# EAGLE schematic KEX V1 (EAGLE 7.5.0)
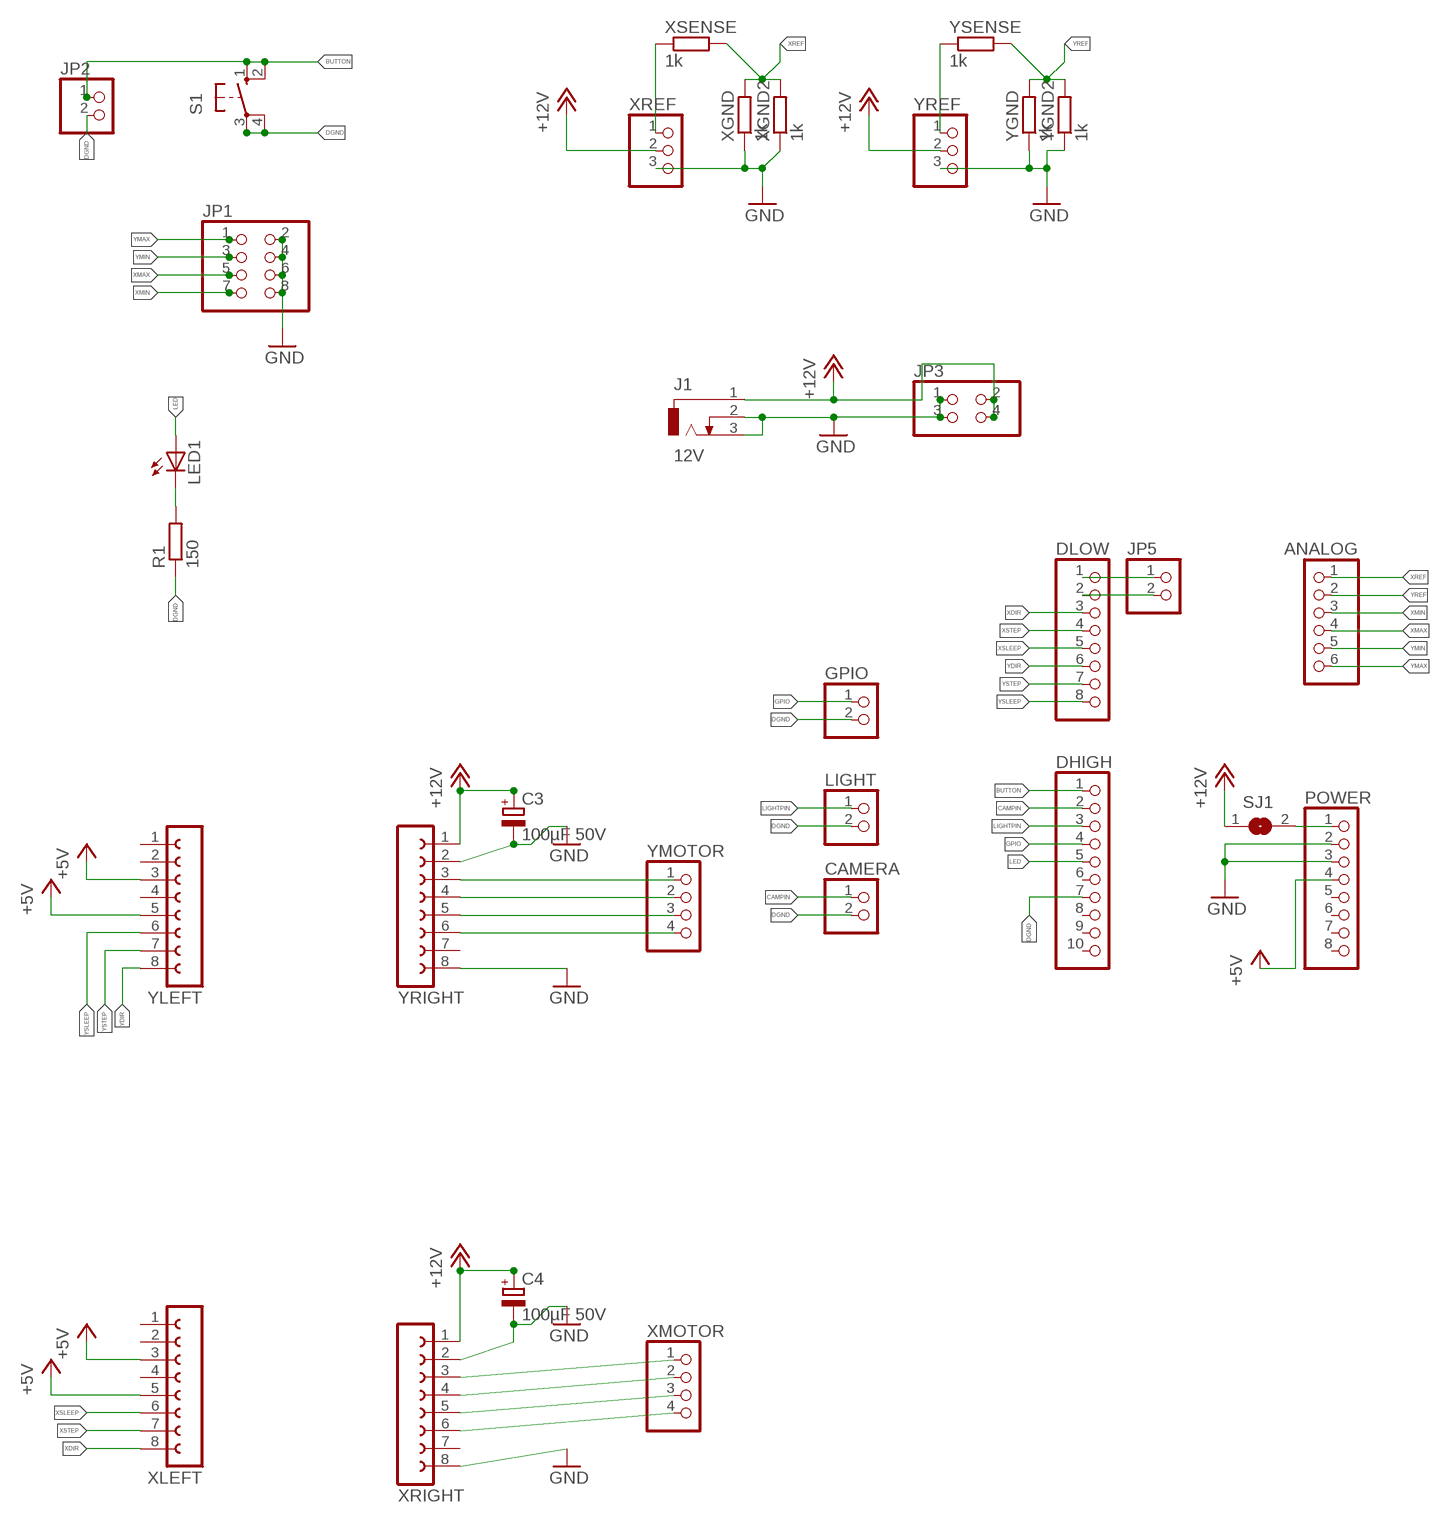
[diagram p0: schematic, sheet 1]

## Parts
ANALOG  PINHD-1X6  [1X06]
C3  100µF 50V  CPOL-EUE3.5-8  [E3,5-8]
C4  100µF 50V  CPOL-EUE3.5-8  [E3,5-8]
CAMERA  PINHD-1X2  [1X02]
DHIGH  PINHD-1X10  [1X10]
DLOW  PINHD-1X8  [1X08]
GPIO  PINHD-1X2  [1X02]
J1  12V  DCJ0303  [DCJ0303]
JP1  PINHD-2X4  [2X04]
JP2  PINHD-1X2  [1X02]
JP3  PINHD-2X2  [2X02]
JP5  PINHD-1X2  [1X02]
LED1  LED5MM  [LED5MM]
LIGHT  PINHD-1X2  [1X02]
POWER  PINHD-1X8  [1X08]
R1  150  R-EU_0204/7  [0204/7]
S1  10-XX  [B3F-10XX]
SJ1  SJ  [SJ]
XGND  1k  R-EU_0204/7  [0204/7]
XGND2  1k  R-EU_0204/7  [0204/7]
XLEFT  FE08-1  [FE08]
XMOTOR  PINHD-1X4  [1X04]
XREF  PINHD-1X3  [1X03]
XRIGHT  FE08-1  [FE08]
XSENSE  1k  R-EU_0204/7  [0204/7]
YGND  1k  R-EU_0204/7  [0204/7]
YGND2  1k  R-EU_0204/7  [0204/7]
YLEFT  FE08-1  [FE08]
YMOTOR  PINHD-1X4  [1X04]
YREF  PINHD-1X3  [1X03]
YRIGHT  FE08-1  [FE08]
YSENSE  1k  R-EU_0204/7  [0204/7]

## Nets
+5V: POWER.4 XLEFT.3 XLEFT.5 YLEFT.3 YLEFT.5
+12V: C3.+ C4.+ J1.1 JP3.2 JP3.4 SJ1.1 XREF.2 XRIGHT.1 YREF.2 YRIGHT.1
BUTTON: DHIGH.1 JP2.1 S1.1(S) S1.2(S1)
CAMPIN: CAMERA.1 DHIGH.2
DGND: CAMERA.2 DHIGH.7 GPIO.2 JP2.2 LIGHT.2 R1.1 S1.3(P) S1.4(P1)
GND: C3.- C4.- J1.2 J1.3 JP1.2 JP1.4 JP1.6 JP1.8 JP3.1 JP3.3 POWER.2 POWER.3 XGND2.1 XGND.1 XREF.3 XRIGHT.2 XRIGHT.8 YGND2.1 YGND.1 YREF.3 YRIGHT.2 YRIGHT.8
GPIO: DHIGH.4 GPIO.1
LED: DHIGH.5 LED1.A
LIGHTPIN: DHIGH.3 LIGHT.1
N$1: XMOTOR.1 XRIGHT.3
N$2: XMOTOR.2 XRIGHT.4
N$3: XMOTOR.3 XRIGHT.5
N$4: XMOTOR.4 XRIGHT.6
N$5: DLOW.1 JP5.1
N$6: DLOW.2 JP5.2
N$7: YMOTOR.1 YRIGHT.3
N$8: YMOTOR.2 YRIGHT.4
N$9: YMOTOR.3 YRIGHT.5
N$10: YMOTOR.4 YRIGHT.6
N$11: LED1.K(C) R1.2
N$12: POWER.1 SJ1.2
N$16: XREF.1 XSENSE.1
N$17: YREF.1 YSENSE.1
XDIR: DLOW.3 XLEFT.8
XMAX: ANALOG.4 JP1.5
XMIN: ANALOG.3 JP1.7
XREF: ANALOG.1 XGND2.2 XGND.2 XSENSE.2
XSLEEP: DLOW.5 XLEFT.6
XSTEP: DLOW.4 XLEFT.7
YDIR: DLOW.6 YLEFT.8
YMAX: ANALOG.6 JP1.1
YMIN: ANALOG.5 JP1.3
YREF: ANALOG.2 YGND2.2 YGND.2 YSENSE.2
YSLEEP: DLOW.8 YLEFT.6
YSTEP: DLOW.7 YLEFT.7
Unconnected: DHIGH.6 DHIGH.8 DHIGH.9 DHIGH.10 POWER.5 POWER.6 POWER.7 POWER.8 XLEFT.1 XLEFT.2 XLEFT.4 XRIGHT.7 YLEFT.1 YLEFT.2 YLEFT.4 YRIGHT.7

## Library data of the parts
ANALOG = pinhead:PINHD-1X6: PIN HEADER
C3 C4 = resistor:CPOL-EU: POLARIZED CAPACITOR, European symbol
CAMERA GPIO JP2 JP5 LIGHT = pinhead:PINHD-1X2: PIN HEADER
DHIGH = pinhead:PINHD-1X10: PIN HEADER
DLOW POWER = pinhead:PINHD-1X8: PIN HEADER
J1 = con-jack:DCJ0303: DC POWER JACK Source: DCJ0303.pdf; OC_FARNELL: unknown; OC_NEWARK: unknown
JP1 = pinhead:PINHD-2X4: PIN HEADER
JP3 = pinhead:PINHD-2X2: PIN HEADER
LED1 = led:LED: LED OSRAM: - CHIPLED LG R971, LG N971, LY N971, LG Q971, LY Q971, LO R971, LY R971 LH N974, LH R974 LS Q976, LO Q976, LY Q976 LO Q996 - Hyper CHIPLED LW Q18S LB Q993, LB Q99A, LB R99A - SideLED LS A670, LO A670, LY A670, LG A670, LP A670 LB A673, LV A673, LT A673, LW A673 LH A674 LY A675 LS A676, LA A676, LO A676, LY A676, LW A676 LS A679, LY A679, LG A679 - Hyper Micro SIDELED® LS Y876, LA Y876, LO Y876, LY Y876 LT Y87S - SmartLED LW L88C, LW L88S LB L89C, LB L89S, LG L890 LS L89K, LO L89K, LY L89K LS L896, LA L896, LO L896, LY L896 - TOPLED LS T670, LO T670, LY T670, LG T670, LP T670 LSG T670, LSP T670, LSY T670, LOP T670, LYG T670 LG T671, LOG T671, LSG T671 LB T673, LV T673, LT T673, LW T673 LH T674 LS T676, LA T676, LO T676, LY T676, LB T676, LH T676, LSB T676, LW T676 LB T67C, LV T67C, LT T67C, LS T67K, LO T67K, LY T67K, LW E67C LS E67B, LA E67B, LO E67B, LY E67B, LB E67C, LV E67C, LT E67C LW T67C LS T679, LY T679, LG T679 LS T770, LO T770, LY T770, LG T770, LP T770 LB T773, LV T773, LT T773, LW T773 LH T774 LS E675, LA E675, LY E675, LS T675 LS T776, LA T776, LO T776, LY T776, LB T776 LHGB T686 LT T68C, LB T68C - Hyper Mini TOPLED® LB M676 - Mini TOPLED Santana® LG M470 LS M47K, LO M47K, LY M47K Source: http://www.osram.convergy.de LUXEON: - LUMILED® LXK2-PW12-R00, LXK2-PW12-S00, LXK2-PW14-U00, LXK2-PW14-V00 LXK2-PM12-R00, LXK2-PM12-S00, LXK2-PM14-U00 LXK2-PE12-Q00, LXK2-PE12-R00, LXK2-PE12-S00, LXK2-PE14-T00, LXK2-PE14-U00 LXK2-PB12-K00, LXK2-PB12-L00, LXK2-PB12-M00, LXK2-PB14-N00, LXK2-PB14-P00, LXK2-PB14-Q00 LXK2-PR12-L00, LXK2-PR12-M00, LXK2-PR14-Q00, LXK2-PR14-R00 LXK2-PD12-Q00, LXK2-PD12-R00, LXK2-PD12-S00 LXK2-PH12-R00, LXK2-PH12-S00 LXK2-PL12-P00, LXK2-PL12-Q00, LXK2-PL12-R00 Source: www.luxeon.com KINGBRIGHT: KA-3528ASYC Source: www.kingbright.com
R1 XGND XGND2 XSENSE YGND YGND2 YSENSE = resistor:R-EU_: RESISTOR, European symbol
S1 = switch-omron:10-XX: OMRON SWITCH; MPN: B3F-1000; OC_FARNELL: 176432; OC_NEWARK: 36M3542
SJ1 = jumper:SJ: SMD solder JUMPER
XLEFT XRIGHT YLEFT YRIGHT = con-lsta:FE08-1: FEMALE HEADER; OC_FARNELL: unknown; OC_NEWARK: unknown
XMOTOR YMOTOR = pinhead:PINHD-1X4: PIN HEADER
XREF YREF = pinhead:PINHD-1X3: PIN HEADER